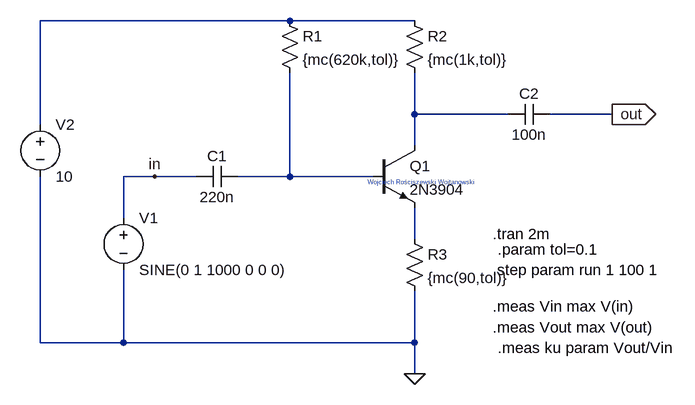
[diagram p0: schematic Homework Initial - TEMP Change.asc]
Homework Initial - TEMP Change.asc, the LTspice schematic file:
Version 4
SHEET 1 880 680
WIRE -512 -896 -896 -896
WIRE -320 -896 -512 -896
WIRE -320 -752 -320 -816
WIRE -176 -752 -320 -752
WIRE -16 -752 -112 -752
WIRE -896 -736 -896 -896
WIRE -320 -704 -320 -752
WIRE -720 -656 -768 -656
WIRE -656 -656 -720 -656
WIRE -512 -656 -512 -816
WIRE -512 -656 -592 -656
WIRE -384 -656 -512 -656
WIRE -768 -592 -768 -656
WIRE -320 -560 -320 -608
WIRE -896 -400 -896 -656
WIRE -768 -400 -768 -512
WIRE -768 -400 -896 -400
WIRE -320 -400 -320 -480
WIRE -320 -400 -768 -400
WIRE -320 -352 -320 -400
FLAG -320 -352 0
FLAG -16 -752 out
IOPIN -16 -752 Out
FLAG -720 -656 in
SYMBOL voltage -768 -608 R0
WINDOW 123 0 0 Left 0
WINDOW 39 0 0 Left 0
SYMATTR InstName V1
SYMATTR Value SINE(0 1 1000 0 0 0)
SYMBOL voltage -896 -752 R0
SYMATTR InstName V2
SYMATTR Value 10
SYMBOL cap -592 -672 R90
WINDOW 0 0 32 VBottom 2
WINDOW 3 32 32 VTop 2
SYMATTR InstName C1
SYMATTR Value 220n
SYMBOL res -528 -912 R0
SYMATTR InstName R1
SYMATTR Value {mc(620k,tol)}
SYMBOL res -336 -912 R0
SYMATTR InstName R2
SYMATTR Value {mc(1k,tol)}
SYMBOL cap -112 -768 R90
WINDOW 0 0 32 VBottom 2
WINDOW 3 32 32 VTop 2
SYMATTR InstName C2
SYMATTR Value 100n
SYMBOL res -336 -576 R0
SYMATTR InstName R3
SYMATTR Value {mc(90,tol)}
SYMBOL npn -384 -704 R0
SYMATTR InstName Q1
SYMATTR Value 2N3904
TEXT -392 -648 Left 0 ;Wojciech Rościszewski Wojtanowski
TEXT -200 -568 Left 2 !.tran 2m
TEXT -200 -456 Left 2 !.meas Vin max V(in)
TEXT -200 -424 Left 2 !.meas Vout max V(out)
TEXT -192 -392 Left 2 !.meas ku param Vout/Vin
TEXT -192 -544 Left 2 !.param tol=0.1
TEXT -200 -512 Left 2 !.step param run 1 100 1

The netlist it stands for:
* Homework Initial - TEMP Change.asc
V1 in 0 SINE(0 1 1000 0 0 0)
V2 N001 0 10
C1 N003 in 220n
R1 N001 N003 {mc(620k,tol)}
R2 N001 N002 {mc(1k,tol)}
C2 out N002 100n
R3 N004 0 {mc(90,tol)}
Q1 N002 N003 N004 0 2N3904
.model NPN NPN
.model PNP PNP
.lib standard.bjt
* Wojciech Rościszewski Wojtanowski
.tran 2m
.meas Vin max V(in)
.meas Vout max V(out)
.meas ku param Vout/Vin
.param tol=0.1
.step param run 1 100 1
.backanno
.end